# EAGLE design M_D_ext_power_usb_centered_M9 (EAGLE 9.6.2)
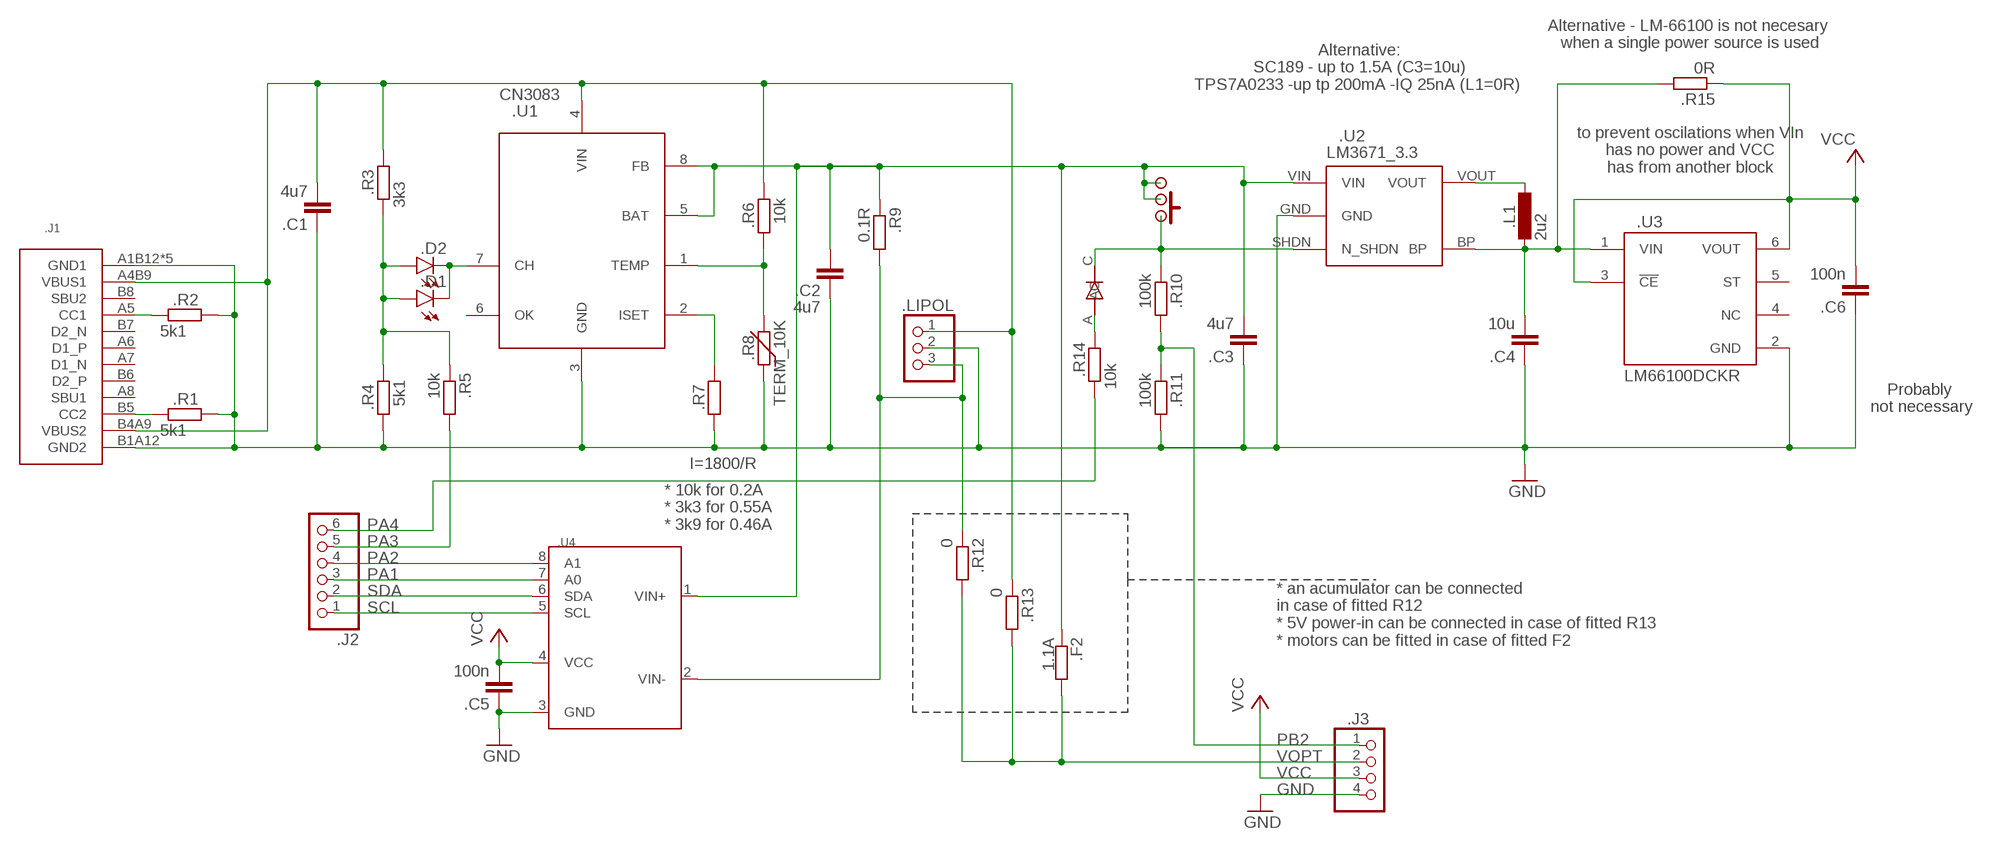
[diagram p0: schematic, sheet 1]

## Parts
Ḋ.BTN  SWITCH  [SWITCH]
Ḋ.C1  4u7  C-EUC0603  [C0603]
Ḋ.C2  4u7  C-EUC0603  [C0603]
Ḋ.C3  4u7  C-EUC0603  [C0603]
Ḋ.C4  10u  C-EUC0603  [C0603]
Ḋ.C5  100n  C-EUC0603  [C0603]
Ḋ.C6  100n  C-EUC0603  [C0603]
Ḋ.D1  LEDCHIP-LED0603  [CHIP-LED0603]
Ḋ.D2  LEDCHIP-LED0603  [CHIP-LED0603]
Ḋ.D3  DIODE  [DIODE]
Ḋ.F2  1.1A  R-EU_R0805  [R0805]
Ḋ.J1  USB-C  [USB-C]
Ḋ.J2  PINHD-1X6  [1X06]
Ḋ.J3  PINHD-1X4  [1X04]
Ḋ.L1  2u2  L-EUL3230M  [L3230M]
Ḋ.LIPOL  PINHEAD-1X3-2  [1X-03-2]
Ḋ.R1  5k1  R-EU_R0603  [R0603]
Ḋ.R2  5k1  R-EU_R0603  [R0603]
Ḋ.R3  3k3  R-EU_R0603  [R0603]
Ḋ.R4  5k1  R-EU_R0603  [R0603]
Ḋ.R5  10k  R-EU_R0603  [R0603]
Ḋ.R6  10k  R-EU_R0603  [R0603]
Ḋ.R7  I=1800/R  R-EU_R0603  [R0603]
Ḋ.R8  TERM_10K  THERM  [THERM]
Ḋ.R9  0.1R  R-EU_R0805  [R0805]
Ḋ.R10  100k  R-EU_R0603  [R0603]
Ḋ.R11  100k  R-EU_R0603  [R0603]
Ḋ.R12  0  R-EU_R0603  [R0603]
Ḋ.R13  0  R-EU_R0603  [R0603]
Ḋ.R14  10k  R-EU_R0603  [R0603]
Ḋ.R15  0R  R-EU_R0603  [R0603]
Ḋ.U1  CN3083  [SOP8]
Ḋ.U2  LM3671_3.3  STABILISER_APE8865  [SOT32-5]
Ḋ.U3  LM66100DCKR  [SOT65P210X110-6N]
Ḋ.U4  INA219  [SOT23-8]

## Nets
5V: Ḋ.C1.2 Ḋ.J1.A4B9(VBUS1) Ḋ.J1.B4A9(VBUS2) Ḋ.LIPOL.1 Ḋ.R3.2 Ḋ.R6.2 Ḋ.R13.1 Ḋ.U1.4(VIN)
CHRG: Ḋ.D1.A1(A) Ḋ.D2.A1(A) Ḋ.R3.1 Ḋ.R4.2 Ḋ.R5.1
GND: Ḋ.C1.1 Ḋ.C2.1 Ḋ.C3.1 Ḋ.C4.1 Ḋ.C5.1 Ḋ.C6.1 Ḋ.J1.A1B12(GND1) Ḋ.J1.B1A12(GND2) Ḋ.J1.SH1(GND1) Ḋ.J1.SH2(GND1) Ḋ.J1.SH3(GND1) Ḋ.J1.SH4(GND1) Ḋ.J3.4 Ḋ.LIPOL.2 Ḋ.R1.2 Ḋ.R2.2 Ḋ.R4.1 Ḋ.R7.1 Ḋ.R8.1 Ḋ.R11.2 Ḋ.U1.3(GND) Ḋ.U2.GND Ḋ.U3.2(GND) Ḋ.U4.3(GND)
IN+: Ḋ.BTN.P$2 Ḋ.BTN.P$3 Ḋ.BTN.P$4 Ḋ.BTN.P$6 Ḋ.C2.2 Ḋ.C3.2 Ḋ.F2.1 Ḋ.R9.1 Ḋ.U1.5(BAT) Ḋ.U1.8(FB) Ḋ.U2.VIN Ḋ.U4.1(VIN+)
IN-: Ḋ.LIPOL.3 Ḋ.R9.2 Ḋ.R12.1 Ḋ.U4.2(VIN-)
N$2: Ḋ.L1.1 Ḋ.U2.VOUT
N$3: Ḋ.D1.C1(C) Ḋ.D2.C1(C) Ḋ.U1.7(CH)
N$4: Ḋ.J1.B5(CC2) Ḋ.R1.1
N$5: Ḋ.D3.A Ḋ.R14.2
N$6: Ḋ.J1.A5(CC1) Ḋ.R2.1
N$7: Ḋ.R7.2 Ḋ.U1.2(ISET)
N$8: Ḋ.R6.1 Ḋ.R8.2 Ḋ.U1.1(TEMP)
N$10: Ḋ.BTN.P$1 Ḋ.BTN.P$5 Ḋ.BTN.P$7 Ḋ.D3.C Ḋ.R10.1 Ḋ.U2.SHDN(N_SHDN)
PA1: Ḋ.J2.3 Ḋ.U4.7(A0)
PA2: Ḋ.J2.4 Ḋ.U4.8(A1)
PA3: Ḋ.J2.5 Ḋ.R5.2
PA4: Ḋ.J2.6 Ḋ.R14.1
PB2: Ḋ.J3.1 Ḋ.R10.2 Ḋ.R11.1
SCL: Ḋ.J2.1 Ḋ.U4.5(SCL)
SDA: Ḋ.J2.2 Ḋ.U4.6(SDA)
VCC: Ḋ.C5.2 Ḋ.C6.2 Ḋ.J3.3 Ḋ.R15.1 Ḋ.U3.3(!CE) Ḋ.U3.6(VOUT) Ḋ.U4.4(VCC)
VCC1: Ḋ.C4.2 Ḋ.L1.2 Ḋ.R15.2 Ḋ.U2.BP Ḋ.U3.1(VIN)
VOPT: Ḋ.F2.2 Ḋ.J3.2 Ḋ.R12.2 Ḋ.R13.2
Unconnected: Ḋ.J1.A6(D1_P) Ḋ.J1.A7(D1_N) Ḋ.J1.A8(SBU1) Ḋ.J1.B6(D2_P) Ḋ.J1.B7(D2_N) Ḋ.J1.B8(SBU2) Ḋ.U1.6(OK) Ḋ.U3.4(NC) Ḋ.U3.5(ST)

## Notes on the sheet
- Alternative - LM-66100 is not necesary 
  when a single power source is used
- Alternative:
  SC189 - up to 1.5A (C3=10u)
  TPS7A0233 -up tp 200mA -IQ 25nA (L1=0R)
- to prevent oscilations when VIn
  has no power and VCC
  has from another block
- Probably 
  not necessary
- * 10k for 0.2A
  * 3k3 for 0.55A
  * 3k9 for 0.46A
- * an acumulator can be connected 
  in case of fitted R12  
  * 5V power-in can be connected in case of fitted R13 
  * motors can be fitted in case of fitted F2

## Library data of the parts
Ḋ.BTN = hugo:SWITCH
Ḋ.C1-Ḋ.C6 = rcl:C-EU: CAPACITOR, European symbol; SPICEPREFIX: C
Ḋ.D1 Ḋ.D2 = led:LED: LED OSRAM: - CHIPLED LG R971, LG N971, LY N971, LG Q971, LY Q971, LO R971, LY R971 LH N974, LH R974 LS Q976, LO Q976, LY Q976 LO Q996 - Hyper CHIPLED LW Q18S LB Q993, LB Q99A, LB R99A - SideLED LS A670, LO A670, LY A670, LG A670, LP A670 LB A673, LV A673, LT A673, LW A673 LH A674 LY A675 LS A676, LA A676, LO A676, LY A676, LW A676 LS A679, LY A679, LG A679 - Hyper Micro SIDELED® LS Y876, LA Y876, LO Y876, LY Y876 LT Y87S - SmartLED LW L88C, LW L88S LB L89C, LB L89S, LG L890 LS L89K, LO L89K, LY L89K LS L896, LA L896, LO L896, LY L896 - TOPLED LS T670, LO T670, LY T670, LG T670, LP T670 LSG T670, LSP T670, LSY T670, LOP T670, LYG T670 LG T671, LOG T671, LSG T671 LB T673, LV T673, LT T673, LW T673 LH T674 LS T676, LA T676, LO T676, LY T676, LB T676, LH T676, LSB T676, LW T676 LB T67C, LV T67C, LT T67C, LS T67K, LO T67K, LY T67K, LW E67C LS E67B, LA E67B, LO E67B, LY E67B, LB E67C, LV E67C, LT E67C LW T67C LS T679, LY T679, LG T679 LS T770, LO T770, LY T770, LG T770, LP T770 LB T773, LV T773, LT T773, LW T773 LH T774 LS E675, LA E675, LY E675, LS T675 LS T776, LA T776, LO T776, LY T776, LB T776 LHGB T686 LT T68C, LB T68C - Hyper Mini TOPLED® LB M676 - Mini TOPLED Santana® LG M470 LS M47K, LO M47K, LY M47K Source: http://www.osram.convergy.de LUXEON: - LUMILED® LXK2-PW12-R00, LXK2-PW12-S00, LXK2-PW14-U00, LXK2-PW14-V00 LXK2-PM12-R00, LXK2-PM12-S00, LXK2-PM14-U00 LXK2-PE12-Q00, LXK2-PE12-R00, LXK2-PE12-S00, LXK2-PE14-T00, LXK2-PE14-U00 LXK2-PB12-K00, LXK2-PB12-L00, LXK2-PB12-M00, LXK2-PB14-N00, LXK2-PB14-P00, LXK2-PB14-Q00 LXK2-PR12-L00, LXK2-PR12-M00, LXK2-PR14-Q00, LXK2-PR14-R00 LXK2-PD12-Q00, LXK2-PD12-R00, LXK2-PD12-S00 LXK2-PH12-R00, LXK2-PH12-S00 LXK2-PL12-P00, LXK2-PL12-Q00, LXK2-PL12-R00 Source: www.luxeon.com KINGBRIGHT: KA-3528ASYC Source: www.kingbright.com
Ḋ.D3 = hugo:DIODE
Ḋ.F2 Ḋ.R1-Ḋ.R7 Ḋ.R9-Ḋ.R15 = rcl:R-EU_: RESISTOR, European symbol; SPICEPREFIX: R
Ḋ.J1 = hugo:USB-C
Ḋ.J2 = pinhead2:PINHD-1X6: PIN HEADER
Ḋ.J3 = pinhead2:PINHD-1X4: PIN HEADER
Ḋ.L1 = rcl:L-EU: INDUCTOR, European symbol; SPICEPREFIX: L
Ḋ.LIPOL = pinhead2:PINHEAD-1X3-2
Ḋ.R8 = hugo:THERM
Ḋ.U1 = hugo:CN3083
Ḋ.U2 = !stavebnice03:STABILISER_APE8865
Ḋ.U3 = LM66100DCKR:LM66100DCKR: Check availability <https://pricing.snapeda.com/parts/LM66100DCKR/Texas%20Instruments/view-part?ref=eda>; AVAILABILITY: In Stock; CHECK_PRICES: https://www.snapeda.com/parts/LM66100DCKR/Texas+Instruments/view-part/?ref=eda; DESCRIPTION: 1.5-V to 5.5-V, 1.5-A, 0.5-µA IQ ideal diode with integrated FET; MF: Texas Instruments; MP: LM66100DCKR; PACKAGE: SOT-SC70-6 Texas Instruments; PRICE: None; SNAPEDA_LINK: https://www.snapeda.com/parts/LM66100DCKR/Texas+Instruments/view-part/?ref=snap
Ḋ.U4 = hugo:INA219: INA219 - I2C Current/Power Monitor Voltage Range: 0-26V Accuracy: 0.5% Temperature: -40°C - 125°C

## Board
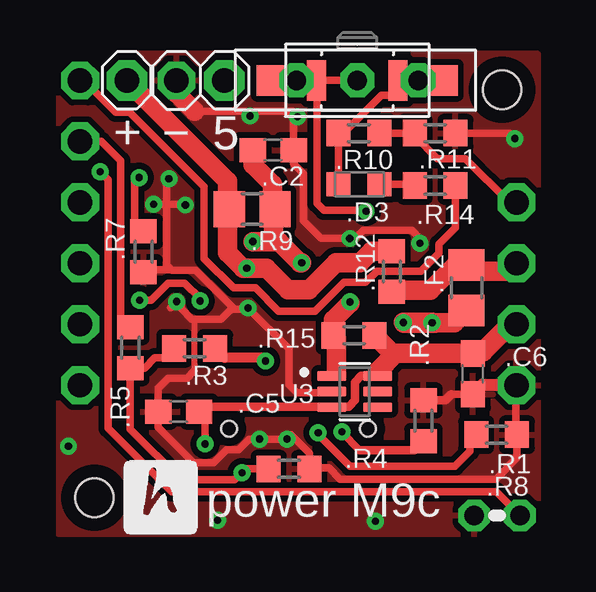
[diagram p1: board, top side]
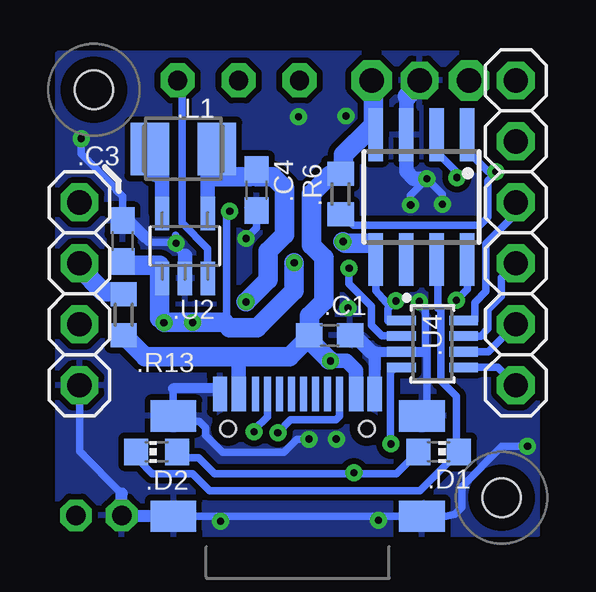
[diagram p2: board, bottom side, seen from below]

No outline drawn. Coordinates in mm, seen from the top.
Copper layers (1*16): Top 0.035mm / dielectric 1.5mm / Bottom 0.035mm
Design rules "default *": minimum track width 10mil, minimum drill 0.3mm, track to track 6mil, track to pad 6mil, pad to pad 6mil, via to via 10mil, smd to smd 10mil, copper to edge 15mil, drill to drill 15mil, minimum pad ring 10mil, minimum via ring 8mil, stop-mask expansion 4mil, vias tented up to drill 14mil, thermal gap 10mil
Holes 1.6 mm at 2,2 19,19
tRestrict: area 18,18 to 20,20; area 1,1 to 3,3
bRestrict: area 1,1 to 3,3; area 18,18 to 20,20

### Footprints (pad centres in the part's own frame; a part is rotated, then mirrored left to right if it is on the bottom)
SWITCH = drill 0.8 pad 1.422 octagon: P$1 2.54,0; P$2 0,0; P$3 -2.54,0 | smd 0.8 x 1.7: P$4 -1.7,0; P$5 1.7,0 | smd 1.27 x 1.27: P$6 -3.556,0; P$7 3.556,0
C0603 = smd 1.1 x 1: 1 -0.85,0; 2 0.85,0
CHIP-LED0603 = smd 1.1 x 1: A1 0,-0.85; C1 0,0.85
DIODE = smd 1 x 1: A 0.85,0; C -0.85,0
R0805 = smd 1.3 x 1.5: 1 -0.95,0; 2 0.95,0
USB-C = smd 0.6 x 1.45: A1B12 -3.235,3.825; A4B9 -2.46,3.825; B1A12 3.215,3.825; B4A9 2.44,3.825 | smd 0.3 x 1.45: A5 -1.26,3.825; A6 -0.26,3.825; A7 0.24,3.825; A8 1.24,3.825; B5 1.74,3.825; B6 0.74,3.825; B7 -0.76,3.825; B8 -1.76,3.825 | smd 1.9 x 1.3: SH1 -5.18,2.91; SH2 -5.18,-1.27; SH3 5.18,-1.27; SH4 5.18,2.91 | hole 0.65: 2.88,2.38; -2.9,2.38
1X06 = drill 1.016 pad 1.575 octagon: 1 -6.35,0; 2 -3.81,0; 3 -1.27,0; 4 1.27,0; 5 3.81,0; 6 6.35,0
1X04 = drill 1.016 pad 1.575 octagon: 1 -3.81,0; 2 -1.27,0; 3 1.27,0; 4 3.81,0
L3230M = smd 1.6 x 2.2: 1 -1.4,0; 2 1.4,0
1X-03-2 = drill 1.016 pad 1.676 octagon: 1 -2.016,0; 3 2.048,0 | drill 1.016 pad 1.575 octagon: 2 -0.016,0
R0603 = smd 1 x 1.1: 1 -0.85,0; 2 0.85,0
THERM = drill 0.813 octagon: 1 -0.953,0; 2 0.953,0
SOP8 = smd 0.6 x 2.2: 1 -1.905,-2.6; 2 -0.635,-2.6; 3 0.635,-2.6; 4 1.905,-2.6; 5 1.905,2.6; 6 0.635,2.6; 7 -0.635,2.6; 8 -1.905,2.6
SOT32-5 = smd 0.6 x 1.4: BP 0.95,1.35; GND 0,-1.35; SHDN 0.95,-1.35; VIN -0.95,-1.35; VOUT -0.95,1.35
SOT65P210X110-6N = smd 1.19 x 0.4: 1 -0.96,0.65; 2 -0.96,0; 3 -0.96,-0.65; 4 0.96,-0.65; 5 0.96,0; 6 0.96,0.65
SOT23-8 = smd 0.4 x 1.2: 1 -0.975,-1.3; 2 -0.325,-1.3; 3 0.325,-1.3; 4 0.975,-1.3; 5 0.975,1.3; 6 0.325,1.3; 7 -0.325,1.3; 8 -0.975,1.3

### Placement (x,y rotation side)
Ḋ.BTN  12.96,19.39 0 top
Ḋ.C1  9.16,8.77 180 bottom
Ḋ.C2  9.45,16.49 180 top
Ḋ.C3  17.81,12.7 270 bottom
Ḋ.C4  12.21,14.82 90 bottom
Ḋ.C5  5.51,5.59 0 top
Ḋ.C6  17.78,7.16 90 top
Ḋ.D1  4.62,3.91 270 bottom
Ḋ.D2  16.38,3.91 90 bottom
Ḋ.D3  13.03,15.06 0 top
Ḋ.F2  17.52,10.75 90 top
Ḋ.J1  10.5,2.5 0 bottom
Ḋ.J2  1.4,13.04 90 bottom
Ḋ.J3  19.6,10.5 270 bottom
Ḋ.L1  15.27,16.54 0 bottom
Ḋ.LIPOL  5.4,19.39 180 top
Ḋ.R1  18.77,4.63 0 top
Ḋ.R2  15.72,5.21 90 top
Ḋ.R3  6.18,8.22 0 top
Ḋ.R4  10.11,3.2 180 top
Ḋ.R5  3.5,8.26 90 top
Ḋ.R6  8.71,14.66 90 bottom
Ḋ.R7  4.05,12.25 90 top
Ḋ.R8  18.79,1.26 0 top
Ḋ.R9  8.58,14.03 180 top
Ḋ.R10  13.03,17.2 0 top
Ḋ.R11  16.21,17.2 0 top
Ḋ.R12  14.4,11.43 270 top
Ḋ.R13  17.75,9.63 90 bottom
Ḋ.R14  16.21,15.01 180 top
Ḋ.R15  12.83,8.76 180 top
Ḋ.U1  5.33,14.53 180 bottom
Ḋ.U2  15.2,12.49 0 bottom
Ḋ.U3  12.85,6.43 0 top
Ḋ.U4  4.88,8.41 270 bottom

### Tracks (layer width: path | path; a pad name or v marks a point on that pad's centre or on a via)
5V  (via drill 0.3)
  Top 0.406: Ḋ.R3.2 7.43,7.83 9.01,7.83 v9.14,7.7
  Bottom 0.305: 8.18,7.43 Ḋ.J1.B4A9
  Bottom 0.61: Ḋ.R6.2 9.22,15.51 9.15,15.44 | 7.34,17.23 Ḋ.U1.4 7.49,17.38 | Ḋ.J1.B4A9 8.07,6.62 8.07,7.31 8.46,7.7 v9.14,7.7 9.19,7.75 | Ḋ.C1.2 10.06,8.83 10.06,9.53 | Ḋ.J1.A4B9 12.96,7.88
  Bottom 0.813: Ḋ.R6.2 8.59,15.63 8.59,16.29 7.49,17.38 | 9.15,15.44 9.93,14.66 9.93,12.53 9.4,12 9.4,10.19 10.01,9.57 Ḋ.C1.2 | 7.34,17.23 7.34,18.88 7.67,19.21 Ḋ.LIPOL.1 | 17.73,8.8 Ḋ.R13.1 16.86,7.88 12.96,7.88 10.83,7.88 10.01,8.7 Ḋ.C1.2 | 9.19,7.75 9.2,7.75 9.99,8.54 9.99,8.75 Ḋ.C1.2
CHRG  (via drill 0.3)
  Top 0.305: Ḋ.R4.2 8.31,3.2 v8.15,3.05 7.85,2.74 5.61,2.74 3.5,4.86 Ḋ.R5.1 4.08,7.41 4.52,7.84 4.95,7.84 Ḋ.R3.1
  Bottom 0.305: Ḋ.D1.A1 6.39,3 8.1,3 v8.15,3.05 8.2,3 13.97,3 14.63,3.66 15.28,3.66 Ḋ.D2.A1
GND  (via drill 0.3)
  Top 0.254: 6.16,9.44 6.16,7.29
  Top 0.305: 19.48,17.02 v19.53,16.97 19.3,17.2 Ḋ.R11.2 | 8.59,18.11 10.26,18.11 10.3,18.07 Ḋ.C2.1 10.3,15.91 10.72,15.5 10.72,13.54 11.44,12.82 12.63,12.82 v12.65,12.8 12.51,12.66 12.73,12.66 13.21,13.14 15.23,13.14 15.57,12.8 v15.57,12.6 | 8.59,18.11 6.17,18.11 | v5.43,10.18 5.45,10.18 | Ḋ.R7.1 4.15,11.51 5.21,11.51 | 7.85,9.86 6.22,11.48 5.23,11.48 5.21,11.51 | 5.21,11.51 5,11.71 5,15.19 v5.11,15.29 | v8.48,17.91 8.59,18.01 8.59,18.11 | 16.89,6.31 Ḋ.C6.1 18.18,6.71 | v5.43,10.18 5.62,9.99 5.62,9.89 6.06,9.44 6.16,9.44 7.27,9.44 7.69,9.86 7.85,9.86 | Ḋ.U3.2 11.84,6.38 10.44,6.38 10.11,6.71 10.11,8.2 v8.41,9.91 8.36,9.86 7.85,9.86 | 5.17,9.92 v5.43,10.18 | 19.57,6.71 19.57,4.68 Ḋ.R1.2 19.62,3.67 18.73,2.78 12.25,2.78 11.77,3.25 11.01,3.25 Ḋ.R4.1 10.96,3.86 10.21,4.62 v10.03,4.45 v8.89,4.45 8.45,4.45 8,4 7.51,4 6.97,3.46 6.14,3.46 4.66,4.94 Ḋ.C5.1 4.66,6.57 5.08,6.99 5.86,6.99 6.16,7.29 | v4.47,14.22 5.77,14.22 v5.79,14.2
  Top 0.356: 16.89,6.31 16.64,6.06 Ḋ.R2.2
  Top 0.406: 19.57,6.71 Ḋ.J3.4
  Top 0.508: 18.18,6.71 19.57,6.71
  Top 0.61: 5.44,18.84 5.42,18.89 Ḋ.LIPOL.2
  Top 0.813: 6.17,18.11 5.44,18.84
  Bottom 0.305: 8.57,8.52 Ḋ.C1.1 8.13,8.78 | v19.53,16.97 19.53,16.33 18.06,14.86 18.06,14.82 17.8,14.57 Ḋ.C3.1 17.78,13.53 17.53,13.53 | 7.44,8.08 7.29,8.08 | 5.3,8.07 5.17,8.2 | 5.17,8.2 5.12,8.25 5.12,5.79 5.22,5.69 Ḋ.J1.SH4 | 5.17,8.2 5.17,9.84 5.51,10.18 v5.43,10.18 | Ḋ.U4.3 | 15.2,12.08 15.6,12.47 15.6,12.93 | v15.57,12.6 15.57,12.65 16.74,12.65 16.87,12.78 16.87,12.86 | v12.65,12.8 12.21,13.24 Ḋ.C4.1 | v4.47,14.22 4.47,14.66 v5.11,15.29 5.79,14.61 v5.79,14.2 | Ḋ.J1.SH2 Ḋ.J1.SH3 4.32,1.23 3.95,1.31 3.66,1.6 3.66,2.46 1.98,4.14 v0.91,4.14 | 17.66,1.23 17.7,1.26 Ḋ.R8.1 | 17.84,2.18 19.6,3.94 Ḋ.J3.4 | Ḋ.J1.A1B12 13.83,6.55 | 15.7,6.55 15.7,5.71 Ḋ.J1.SH1 15.45,5.18 14.61,5.18 14.34,4.91 14.34,4.6 13.63,3.9 11.07,3.9 10.52,4.45 v10.03,4.45
  Bottom 0.406: 7.29,8.08 Ḋ.U4.3 | Ḋ.U4.3 5.3,8.07 | 13.83,6.55 15.7,6.55
  Bottom 0.508: Ḋ.J1.SH2 17.66,1.23 | Ḋ.R8.1 17.84,2.18 | Ḋ.J1.B1A12 7.29,8.08 | 16.87,12.86 17.53,13.53
  Bottom 0.61: 15.2,12.08 Ḋ.U2.GND | Ḋ.LIPOL.2 5.42,19.24 | 8.13,8.78 7.44,8.08 | v5.11,15.29 5.66,15.29 5.97,15.6 Ḋ.U1.3 5.97,18.68 5.92,18.73
  Bottom 0.813: 5.42,19.24 5.92,18.73
  other vias: 10.46,17.88 7.14,1.07 13.72,1.02
  pour Top (isolate 0.254): 0.5,20.5 0.5,0.5 20.5,0.5 20.5,20.5
  pour Bottom (isolate 0.254, rank 3): 0.5,20.5 20.5,20.5 20.5,0.5 0.5,0.5
IN+  (via drill 0.3)
  Top 0.305: Ḋ.BTN.P$6 Ḋ.BTN.P$3 Ḋ.BTN.P$4 | 12.94,19.39 Ḋ.BTN.P$2 Ḋ.BTN.P$4 | v13.33,13.93 13.28,13.98 11.58,13.98 11.29,14.28 11.29,19.36 Ḋ.BTN.P$4 | v6.4,10.2 6.4,10.3 5.77,10.94 5.07,10.94 4.36,10.23 v3.88,10.23
  Top 0.813: Ḋ.R9.1 9.42,14.13 9.42,15.06 8.6,15.88 Ḋ.C2.2 | Ḋ.R9.1 9.61,14.03 | Ḋ.R9.1 9.47,13.97 9.47,12.68 v8.6,12.68 9.69,12.68 10.57,11.8 v10.64,11.8 | Ḋ.F2.1 17.4,9.68 | Ḋ.F2.1 17.46,9.8 | v16.08,9.3 v16.09,9.3 | v16.08,9.3 v16.07,9.3 v14.88,9.3 14.91,9.28 16.2,9.28 | v16.08,9.3 17.01,9.3 Ḋ.F2.1
  Bottom 0.305: Ḋ.U2.VIN 16.25,11.24 | v13.33,13.93 13.33,13.88 13.46,13.75 13.46,9.3 v14.88,9.3 | Ḋ.U4.1 6.74,9.38 6.74,9.87 v6.4,10.2 6.68,9.99 7.24,10.63 Ḋ.U1.5 | v3.88,10.23 3.43,10.68 Ḋ.U1.8
  Bottom 0.508: 7.37,12.6 7.24,12.72 | 7.24,12.42 7.19,12.47
  Bottom 0.61: 7.24,12.52 Ḋ.U1.5 7.24,12.42 7.24,12.72 | 16.25,11.7 16.15,11.6 Ḋ.U2.VIN 16.15,11.16 16.25,11.27 | 17.65,11.7 Ḋ.C3.2 | 16.25,9.47 v16.08,9.3
  Bottom 0.813: v8.6,12.68 8.53,12.6 7.37,12.6 | v10.64,11.8 10.64,10.62 12.19,9.07 13.34,9.07 13.56,9.3 v14.88,9.3 16.07,9.3 | 17.65,11.7 16.25,11.7 | 16.25,11.27 16.25,9.47
IN-  (via drill 0.3)
  Top 0.813: Ḋ.LIPOL.3 7.55,15.19 7.55,14.33 7.62,14.25 Ḋ.R9.2 7.62,13.57 7.54,13.49 7.54,12.21 8.19,11.56 v8.35,11.56 9.17,11.56 10.07,10.66 10.95,10.66 12.08,11.79 13.07,11.79 13.56,12.28 Ḋ.R12.1
  Bottom 0.305: Ḋ.U4.2 6.2,8.75 6.98,8.75 7.41,9.19 7.41,9.99 8.35,10.93 v8.35,11.56
N$2
  Bottom 0.61: Ḋ.U2.VOUT 16.15,15.41 16.41,15.67 | Ḋ.L1.1 16.41,16.54
  Bottom 1.016: 16.41,16.54 16.41,15.67
N$3
  Bottom 0.305: Ḋ.U1.7 4.65,11.88 4.65,9.91 4.53,9.79 4.53,6.88 3.87,6.22 3.87,4.01 Ḋ.D1.C1 5.4,2.29 14.18,2.29 14.88,3 16.56,3 17.12,3.56 17.12,3.91 Ḋ.D2.C1
N$4  (via drill 0.3)
  Top 0.305: Ḋ.R1.1 17.66,4.38 17.66,3.95 17.03,3.31 12.66,3.31 11.33,4.65 v11.33,4.71
  Bottom 0.305: v11.33,4.71 10.8,5.24 8.91,5.24 8.76,5.39 Ḋ.J1.B5
N$5
  Top 0.305: Ḋ.R14.2 15.3,15.06 Ḋ.D3.A
N$6  (via drill 0.3)
  Top 0.305: v12.32,4.75 12.32,4.72 13.06,3.99
  Top 0.356: 13.06,3.99 15.35,3.99 Ḋ.R2.1
  Bottom 0.305: v12.32,4.75 12.32,4.83 11.76,5.38 Ḋ.J1.A5
N$7  (via drill 0.3)
  Top 0.305: v3.86,15.34 3.68,15.16 3.68,13.46 Ḋ.R7.2
  Bottom 0.305: Ḋ.U1.2 4.57,17 4.57,16.27 3.86,15.55 v3.86,15.34
N$8  (via drill 0.3)
  Top 0.305: v2.24,15.59 2.56,15.26 2.56,4.89 5.21,2.25 18.76,2.25 Ḋ.R8.2
  Bottom 0.305: Ḋ.U1.1 3.4,17.1 3.4,16.44 2.55,15.59 v2.24,15.59 2.24,15.53 2.57,15.2 2.57,13.68 2.9,13.35 8.18,13.35 8.64,13.81 Ḋ.R6.1
N$10
  Top 0.305: Ḋ.BTN.P$1 Ḋ.BTN.P$5 14.66,19.32 | Ḋ.BTN.P$1 15.36,19.35 | Ḋ.BTN.P$1 Ḋ.BTN.P$7 | Ḋ.BTN.P$1 14.94,19.39 14.33,18.78 13.97,18.78 12.38,17.2 Ḋ.R10.1 Ḋ.D3.C
  Bottom 0.305: Ḋ.U2.SHDN 14.25,12.38 15.33,13.46 15.33,19.21 Ḋ.BTN.P$1
PA1
  Bottom 0.305: Ḋ.U4.7 2.87,8.73 2.57,9.03 2.57,9.84 2.01,10.39 2.01,11.16 Ḋ.J2.3
PA2
  Bottom 0.305: Ḋ.J2.4 1.4,13.83 2.65,12.58 2.65,10.6 3.12,10.13 3.12,9.38 Ḋ.U4.8
PA3
  Top 0.305: Ḋ.R5.2 3.1,9.51 3.1,16.04 2.29,16.85 Ḋ.J2.5
PA4
  Top 0.305: Ḋ.R14.1 17.05,13.26 16.36,12.55 16.36,12.19 15.61,11.44 13.78,11.44 13.31,10.98 12.39,10.98 11.2,9.78 9.68,9.78 8.71,10.74 7.79,10.74 6.58,11.96 6.58,14.96 3.47,18.07 2.88,18.07 1.56,19.39 Ḋ.J2.6 1.58,19.39
PB2
  Top 0.305: Ḋ.J3.1 19.3,14.31 17.48,16.13 16.31,16.13 15.36,17.08 Ḋ.R11.1 Ḋ.R10.2
SCL
  Bottom 0.305: Ḋ.U4.5 2.14,7.43 Ḋ.J2.1
SDA
  Bottom 0.305: Ḋ.J2.2 2.54,8.08 Ḋ.U4.6
VCC  (via drill 0.3)
  Top 0.305: 13.94,7.11 13.85,7.11 Ḋ.U3.6 | Ḋ.C6.2 19,9.23 Ḋ.J3.3 | Ḋ.C5.2 6.61,5.34 v6.61,4.24 | Ḋ.U3.3 11.91,5.79
  Top 0.356: 11.91,5.79 12.61,5.79 12.87,6.05 12.87,6.82 13.12,7.08 Ḋ.U3.6 | Ḋ.U3.3 11.88,5.79 6.53,5.79
  Top 0.406: Ḋ.C5.2 6.36,5.62 6.53,5.79 | Ḋ.U3.6 13.81,7.27
  Top 0.61: 19.37,9.23 Ḋ.J3.3
  Top 0.813: 19.37,9.23 18.21,8.07 | 14.56,8.01 13.81,7.27 | Ḋ.C6.2 14.56,8.01 | 14.56,8.01 14.43,8.01 Ḋ.R15.1
  Bottom 0.305: Ḋ.U4.4 6.43,7.43 6.63,7.23 6.63,4.27 v6.61,4.24
VCC1  (via drill 0.3)
  Top 0.406: Ḋ.R15.2 12.1,8.64 | 12.1,7.36 11.89,7.15 Ḋ.U3.1
  Top 0.61: v12.65,10.16 12.65,10.1
  Top 0.813: 12.65,10.1 11.98,9.42 Ḋ.R15.2 | 12.1,8.64 12.1,7.36
  Bottom 0.305: Ḋ.C4.2 12.21,15.37
  Bottom 0.406: Ḋ.U2.BP 14.25,14.07
  Bottom 0.508: 14.25,16.15 Ḋ.L1.2
  Bottom 0.61: Ḋ.U2.BP 14.25,16.15
  Bottom 0.813: v12.65,10.16 11.74,11.07 11.74,12.27 11.05,12.96 11.05,14.89 11.53,15.37 12.21,15.37 | Ḋ.L1.2 13.89,16.51 13.89,15.88 13.92,15.9 13.92,15.37 12.51,15.37 Ḋ.C4.2
VOPT
  Top 0.813: Ḋ.J3.2 19.27,11.44 17.77,11.44 Ḋ.F2.2 17.5,11.68 17.06,11.68 16.02,10.64 14.46,10.64 Ḋ.R12.2
  Bottom 0.813: Ḋ.R13.2 17.87,10.59 18.61,10.59 19.6,11.58 Ḋ.J3.2

### Text on the board
tPlace: + | − | 5 | power M9c